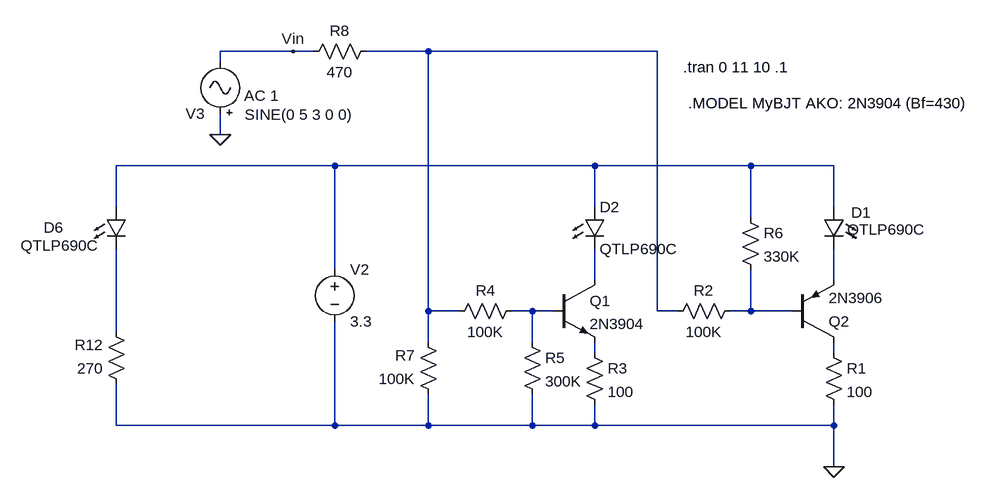
[diagram p0: schematic sparkplug.asc]
sparkplug.asc, the LTspice schematic file:
Version 4
SHEET 1 880 724
WIRE -192 48 -304 48
WIRE -160 48 -192 48
WIRE 16 48 -80 48
WIRE 368 48 16 48
WIRE -304 64 -304 48
WIRE -304 176 -304 144
WIRE -128 224 -464 224
WIRE 272 224 -128 224
WIRE 512 224 272 224
WIRE 640 224 512 224
WIRE -464 288 -464 224
WIRE 272 288 272 224
WIRE 640 288 640 224
WIRE 512 304 512 224
WIRE -128 384 -128 224
WIRE 272 400 272 352
WIRE 640 400 640 352
WIRE 16 448 16 48
WIRE 64 448 16 448
WIRE 176 448 144 448
WIRE 208 448 176 448
WIRE 368 448 368 48
WIRE 400 448 368 448
WIRE 512 448 512 384
WIRE 512 448 480 448
WIRE 576 448 512 448
WIRE -464 480 -464 352
WIRE 16 496 16 448
WIRE 176 496 176 448
WIRE 272 512 272 496
WIRE 640 512 640 496
WIRE -464 624 -464 560
WIRE -128 624 -128 464
WIRE -128 624 -464 624
WIRE 16 624 16 576
WIRE 16 624 -128 624
WIRE 176 624 176 576
WIRE 176 624 16 624
WIRE 272 624 272 592
WIRE 272 624 176 624
WIRE 640 624 640 592
WIRE 640 624 272 624
WIRE 640 688 640 624
FLAG 640 688 0
FLAG -192 48 Vin
FLAG -304 176 0
SYMBOL res 624 496 R0
SYMATTR InstName R1
SYMATTR Value 100
SYMBOL npn 208 400 R0
SYMATTR InstName Q1
SYMATTR Value 2N3904
SYMBOL res 496 432 R90
WINDOW 0 0 56 VBottom 2
WINDOW 3 32 56 VTop 2
SYMATTR InstName R2
SYMATTR Value 100K
SYMBOL Misc\\signal -304 160 R180
WINDOW 123 -90 44 Left 2
WINDOW 39 0 0 Left 0
WINDOW 3 -204 15 Left 2
SYMATTR Value2 AC 1
SYMATTR Value SINE(0 5 3 0 0)
SYMATTR InstName V3
SYMBOL voltage -128 368 R0
WINDOW 123 0 0 Left 0
WINDOW 39 0 0 Left 0
SYMATTR InstName V2
SYMATTR Value 3.3
SYMBOL res 256 496 R0
SYMATTR InstName R3
SYMATTR Value 100
SYMBOL pnp 576 496 M180
SYMATTR InstName Q2
SYMATTR Value 2N3906
SYMBOL res 160 432 R90
WINDOW 0 0 56 VBottom 2
WINDOW 3 32 56 VTop 2
SYMATTR InstName R4
SYMATTR Value 100K
SYMBOL LED 256 288 R0
SYMATTR InstName D2
SYMATTR Value QTLP690C
SYMBOL res 160 480 R0
SYMATTR InstName R5
SYMATTR Value 300K
SYMBOL res 496 288 R0
SYMATTR InstName R6
SYMATTR Value 330K
SYMBOL LED 656 288 M0
WINDOW 0 -41 8 Left 2
WINDOW 3 -125 34 Left 2
SYMATTR InstName D1
SYMATTR Value QTLP690C
SYMBOL res 32 592 R180
WINDOW 0 36 76 Left 2
WINDOW 3 36 40 Left 2
SYMATTR InstName R7
SYMATTR Value 100K
SYMBOL res -64 32 R90
WINDOW 0 0 56 VBottom 2
WINDOW 3 32 56 VTop 2
SYMATTR InstName R8
SYMATTR Value 470
SYMBOL LED -480 288 R0
WINDOW 0 -96 31 Left 2
WINDOW 3 -131 59 Left 2
SYMATTR InstName D6
SYMATTR Value QTLP690C
SYMBOL res -448 576 R180
WINDOW 0 36 76 Left 2
WINDOW 3 36 40 Left 2
SYMATTR InstName R12
SYMATTR Value 270
TEXT 408 72 Left 2 !.tran 0 11 10 .1
TEXT 416 128 Left 2 !.MODEL MyBJT AKO: 2N3904 (Bf=430)

The netlist it stands for:
* sparkplug.asc
R1 N009 0 100
Q1 N003 N005 N008 0 2N3904
R2 N006 N001 100K
V3 0 Vin SINE(0 5 3 0 0) AC 1
V2 N002 0 3.3
R3 N008 0 100
Q2 N009 N006 N004 0 2N3906
R4 N005 N001 100K
D2 N002 N003 QTLP690C
R5 N005 0 300K
R6 N002 N006 330K
D1 N002 N004 QTLP690C
R7 0 N001 100K
R8 N001 Vin 470
D6 N002 N007 QTLP690C
R12 0 N007 270
.model D D
.lib standard.dio
.model NPN NPN
.model PNP PNP
.lib standard.bjt
.tran 0 11 10 .1
.MODEL MyBJT AKO: 2N3904 (Bf=430)
.backanno
.end